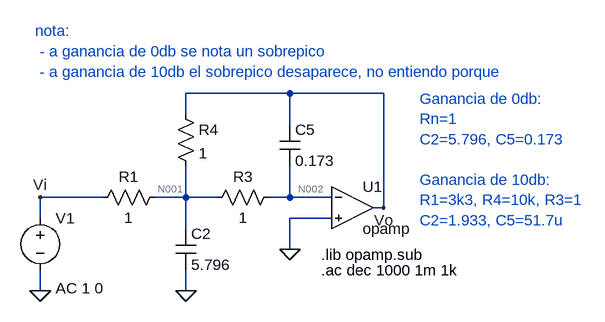
[diagram p0: schematic SOS3_MFB.asc]
SOS3_MFB.asc, the LTspice schematic file:
Version 4.1
SHEET 1 880 680
WIRE 320 -16 160 -16
WIRE 464 -16 320 -16
WIRE 160 16 160 -16
WIRE 320 32 320 -16
WIRE 32 144 -64 144
WIRE 160 144 160 96
WIRE 160 144 112 144
WIRE 208 144 160 144
WIRE 320 144 320 96
WIRE 320 144 288 144
WIRE 384 144 320 144
WIRE 464 160 464 -16
WIRE 464 160 448 160
WIRE -64 176 -64 144
WIRE 384 176 320 176
WIRE 160 192 160 144
WIRE 320 224 320 176
WIRE -64 288 -64 256
WIRE 160 288 160 256
FLAG 320 224 0
FLAG -64 288 0
FLAG 160 288 0
FLAG -64 144 Vi
FLAG 464 160 Vo
SYMBOL res 128 128 R90
WINDOW 0 0 56 VBottom 2
WINDOW 3 32 56 VTop 2
SYMATTR InstName R1
SYMATTR Value 1
SYMBOL res 304 128 R90
WINDOW 0 0 56 VBottom 2
WINDOW 3 32 56 VTop 2
SYMATTR InstName R3
SYMATTR Value 1
SYMBOL res 144 0 R0
SYMATTR InstName R4
SYMATTR Value 1
SYMBOL cap 144 192 R0
SYMATTR InstName C2
SYMATTR Value 5.796
SYMBOL cap 304 32 R0
SYMATTR InstName C5
SYMATTR Value 0.173
SYMBOL OpAmps\\opamp 416 96 R0
SYMATTR InstName U1
SYMBOL voltage -64 160 R0
WINDOW 123 24 124 Left 2
WINDOW 39 0 0 Left 0
SYMATTR Value2 AC 1 0
SYMATTR InstName V1
SYMATTR Value ""
TEXT 368 232 Left 2 !.lib opamp.sub
TEXT 368 256 Left 2 !.ac dec 1000 1m 1k
TEXT 520 -8 Left 2 ;Ganancia de 0db:\nRn=1\nC2=5.796, C5=0.173\n \nGanancia de 10db:\nR1=3k3, R4=10k, R3=1\nC2=1.933, C5=51.7u
TEXT -72 -112 Left 2 ;nota:\n - a ganancia de 0db se nota un sobrepico\n - a ganancia de 10db el sobrepico desaparece, no entiendo porque

The netlist it stands for:
* SOS3_MFB.asc
R1 N001 Vi 1
R3 N002 N001 1
R4 Vo N001 1
C2 N001 0 5.796
C5 Vo N002 0.173
X§U1 N002 0 Vo opamp Aol=100K GBW=10Meg  ; pins invin noninvin out
V1 Vi 0 AC 1 0
.lib opamp.sub
.ac dec 1000 1m 1k
* Ganancia de 0db:
* Rn=1
* C2=5.796, C5=0.173
* Ganancia de 10db:
* R1=3k3, R4=10k, R3=1
* C2=1.933, C5=51.7u
* nota:
*  - a ganancia de 0db se nota un sobrepico
*  - a ganancia de 10db el sobrepico desaparece, no entiendo porque
.backanno
.end

* Results of the author's LTspice run, read from the files saved beside the schematic
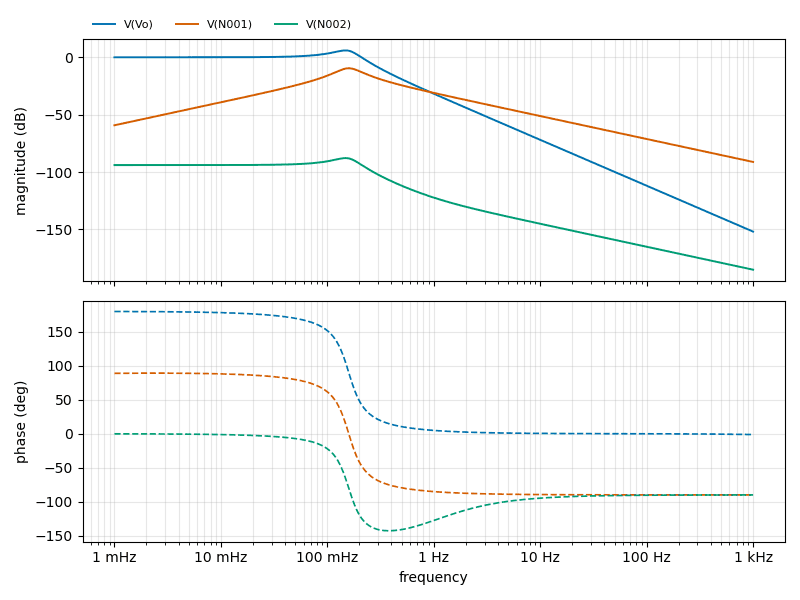
[diagram p1: AC Analysis of SOS3_MFB.asc, plotted from the saved traces]
* AC Analysis, 1 run:
*   V(Vo): -0.00 dB at 1 mHz, -151.95 dB at 1 kHz, peak 6.01 dB at 147.9 mHz, 3 dB below the peak at 96.02 mHz and 185.8 mHz
*   V(N001): -59.27 dB at 1 mHz, -91.23 dB at 1 kHz, peak -9.54 dB at 158.9 mHz, 3 dB below the peak at 123 mHz and 205.4 mHz
*   V(N002): -93.98 dB at 1 mHz, -185.17 dB at 1 kHz, peak -87.86 dB at 148.3 mHz, 3 dB below the peak at 96.98 mHz and 186.3 mHz